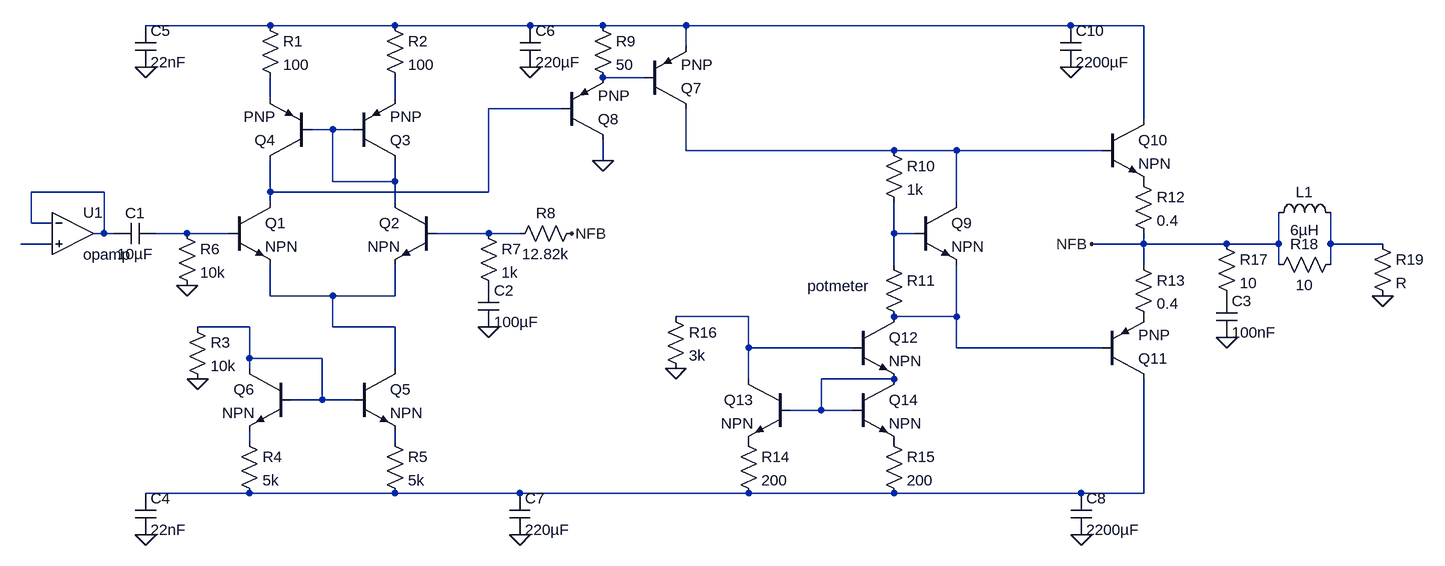
[diagram p0: schematic pa_after_theoretical_design.asc]
pa_after_theoretical_design.asc, the LTspice schematic file:
Version 4
SHEET 1 1796 680
WIRE 16 -160 -176 -160
WIRE 208 -160 16 -160
WIRE 416 -160 208 -160
WIRE 528 -160 416 -160
WIRE 656 -160 528 -160
WIRE 1248 -160 656 -160
WIRE 1360 -160 1248 -160
WIRE 656 -128 656 -160
WIRE 592 -80 528 -80
WIRE 16 -48 16 -80
WIRE 208 -48 208 -80
WIRE 464 -32 352 -32
WIRE 1360 -16 1360 -160
WIRE 112 0 80 0
WIRE 144 0 112 0
WIRE 656 32 656 -32
WIRE 976 32 656 32
WIRE 1072 32 976 32
WIRE 1296 32 1072 32
WIRE 528 48 528 16
WIRE 112 80 112 0
WIRE 208 80 208 48
WIRE 208 80 112 80
WIRE -240 96 -352 96
WIRE 16 96 16 48
WIRE 352 96 352 -32
WIRE 352 96 16 96
WIRE 16 112 16 96
WIRE 208 112 208 80
WIRE 1072 112 1072 32
WIRE -352 144 -352 96
WIRE -320 144 -352 144
WIRE -240 160 -240 96
WIRE -240 160 -256 160
WIRE -224 160 -240 160
WIRE -112 160 -160 160
WIRE -48 160 -112 160
WIRE 352 160 272 160
WIRE 400 160 352 160
WIRE 976 160 976 112
WIRE 1008 160 976 160
WIRE -320 176 -368 176
WIRE 1360 176 1360 160
WIRE 1360 176 1280 176
WIRE 1488 176 1360 176
WIRE 1568 176 1568 128
WIRE 1568 176 1488 176
WIRE 1648 176 1648 128
WIRE 1728 176 1648 176
WIRE 976 208 976 160
WIRE 1360 208 1360 176
WIRE 1568 208 1568 176
WIRE 1648 208 1648 176
WIRE 16 256 16 208
WIRE 112 256 16 256
WIRE 208 256 208 208
WIRE 208 256 112 256
WIRE 752 288 640 288
WIRE 1072 288 1072 208
WIRE 1072 288 976 288
WIRE -16 304 -96 304
WIRE 112 304 112 256
WIRE 208 304 112 304
WIRE 752 336 752 288
WIRE 912 336 752 336
WIRE 1072 336 1072 288
WIRE 1296 336 1072 336
WIRE -16 352 -16 304
WIRE 96 352 -16 352
WIRE -16 368 -16 352
WIRE 208 368 208 304
WIRE 752 384 752 336
WIRE 976 384 864 384
WIRE 96 416 96 352
WIRE 96 416 48 416
WIRE 144 416 96 416
WIRE 864 432 864 384
WIRE 864 432 816 432
WIRE 912 432 864 432
WIRE -16 480 -16 464
WIRE 208 480 208 464
WIRE -16 560 -176 560
WIRE 208 560 -16 560
WIRE 400 560 208 560
WIRE 752 560 400 560
WIRE 976 560 752 560
WIRE 1264 560 976 560
WIRE 1360 560 1360 384
WIRE 1360 560 1264 560
FLAG -96 384 0
FLAG -112 240 0
FLAG 352 304 0
FLAG 480 160 NFB
FLAG 528 48 0
FLAG 640 368 0
FLAG 1280 176 NFB
FLAG 1488 320 0
FLAG 1728 256 0
FLAG 1248 -96 0
FLAG 416 -96 0
FLAG -176 -96 0
FLAG -176 624 0
FLAG 400 624 0
FLAG 1264 624 0
SYMBOL npn -48 112 R0
SYMATTR InstName Q1
SYMBOL npn 272 112 M0
SYMATTR InstName Q2
SYMBOL pnp 144 48 M180
SYMATTR InstName Q3
SYMBOL pnp 80 48 R180
SYMATTR InstName Q4
SYMBOL res 0 -176 R0
SYMATTR InstName R1
SYMATTR Value 100
SYMBOL res 192 -176 R0
SYMATTR InstName R2
SYMATTR Value 100
SYMBOL npn 144 368 R0
SYMATTR InstName Q5
SYMBOL npn 48 368 M0
SYMATTR InstName Q6
SYMBOL res -112 288 R0
SYMATTR InstName R3
SYMATTR Value 10k
SYMBOL res -32 464 R0
SYMATTR InstName R4
SYMATTR Value 5k
SYMBOL res 192 464 R0
SYMATTR InstName R5
SYMATTR Value 5k
SYMBOL res -128 144 R0
SYMATTR InstName R6
SYMATTR Value 10k
SYMBOL cap -160 144 R90
WINDOW 0 0 32 VBottom 2
WINDOW 3 32 32 VTop 2
SYMATTR InstName C1
SYMATTR Value 10µF
SYMBOL OpAmps\\opamp -288 96 R0
SYMATTR InstName U1
SYMBOL res 336 144 R0
SYMATTR InstName R7
SYMATTR Value 1k
SYMBOL res 496 144 R90
WINDOW 0 0 56 VBottom 2
WINDOW 3 32 56 VTop 2
SYMATTR InstName R8
SYMATTR Value 12.82k
SYMBOL cap 336 240 R0
SYMATTR InstName C2
SYMATTR Value 100µF
SYMBOL pnp 592 -32 M180
SYMATTR InstName Q7
SYMBOL pnp 464 16 M180
SYMATTR InstName Q8
SYMBOL res 512 -176 R0
SYMATTR InstName R9
SYMATTR Value 50
SYMBOL npn 1008 112 R0
SYMATTR InstName Q9
SYMBOL res 960 16 R0
SYMATTR InstName R10
SYMATTR Value 1k
SYMBOL res 960 192 R0
WINDOW 3 -117 49 Left 2
SYMATTR Value potmeter
SYMATTR InstName R11
SYMBOL npn 1296 -16 R0
SYMATTR InstName Q10
SYMBOL pnp 1296 384 M180
SYMATTR InstName Q11
SYMBOL res 1344 64 R0
SYMATTR InstName R12
SYMATTR Value 0.4
SYMBOL res 1344 192 R0
SYMATTR InstName R13
SYMATTR Value 0.4
SYMBOL npn 912 288 R0
SYMATTR InstName Q12
SYMBOL npn 816 384 M0
SYMATTR InstName Q13
SYMBOL npn 912 384 R0
SYMATTR InstName Q14
SYMBOL res 736 464 R0
SYMATTR InstName R14
SYMATTR Value 200
SYMBOL res 960 464 R0
SYMATTR InstName R15
SYMATTR Value 200
SYMBOL res 624 272 R0
SYMATTR InstName R16
SYMATTR Value 3k
SYMBOL res 1472 160 R0
SYMATTR InstName R17
SYMATTR Value 10
SYMBOL cap 1472 256 R0
SYMATTR InstName C3
SYMATTR Value 100nF
SYMBOL ind 1552 144 R270
WINDOW 0 32 56 VTop 2
WINDOW 3 5 56 VBottom 2
SYMATTR InstName L1
SYMATTR Value 6µH
SYMBOL res 1664 192 R90
WINDOW 0 0 56 VBottom 2
WINDOW 3 32 56 VTop 2
SYMATTR InstName R18
SYMATTR Value 10
SYMBOL res 1712 160 R0
SYMATTR InstName R19
SYMBOL cap -192 560 R0
SYMATTR InstName C4
SYMATTR Value 22nF
SYMBOL cap -192 -160 R0
SYMATTR InstName C5
SYMATTR Value 22nF
SYMBOL cap 400 -160 R0
SYMATTR InstName C6
SYMATTR Value 220µF
SYMBOL cap 384 560 R0
SYMATTR InstName C7
SYMATTR Value 220µF
SYMBOL cap 1248 560 R0
SYMATTR InstName C8
SYMATTR Value 2200µF
SYMBOL cap 1232 -160 R0
SYMATTR InstName C10
SYMATTR Value 2200µF

The netlist it stands for:
* pa_after_theoretical_design.asc
Q1 N005 N009 N014 0 NPN
Q2 N006 N010 N014 0 NPN
Q3 N006 N006 N004 0 PNP
Q4 N005 N006 N003 0 PNP
R1 N001 N003 100
R2 N001 N004 100
Q5 N014 N017 N020 0 NPN
Q6 N017 N017 N019 0 NPN
R3 N017 0 10k
R4 N019 N021 5k
R5 N020 N021 5k
R6 N009 0 10k
C1 N009 N008 10µF
XU1 N008 N012 N008 opamp Aol=100K GBW=10Meg  ; pins invin noninvin out
R7 N010 P001 1k
R8 NFB N010 12.82k
C2 P001 0 100µF
Q7 N007 N002 N001 0 PNP
Q8 0 N005 N002 0 PNP
R9 N001 N002 50
Q9 N007 N011 N016 0 NPN
R10 N007 N011 1k
R11 N011 N016 potmeter
Q10 N001 N007 P002 0 NPN
Q11 N021 N016 P003 0 PNP
R12 P002 NFB 0.4
R13 NFB P003 0.4
Q12 N016 N015 N018 0 NPN
Q13 N015 N018 P004 0 NPN
Q14 N018 N018 P005 0 NPN
R14 P004 N021 200
R15 P005 N021 200
R16 N015 0 3k
R17 NFB P006 10
C3 P006 0 100nF
L1 NFB N013 6µH
R18 N013 NFB 10
R19 N013 0 R
C4 N021 0 22nF
C5 N001 0 22nF
C6 N001 0 220µF
C7 N021 0 220µF
C8 N021 0 2200µF
C10 N001 0 2200µF
.model NPN NPN
.model PNP PNP
.lib standard.bjt
.backanno
.end